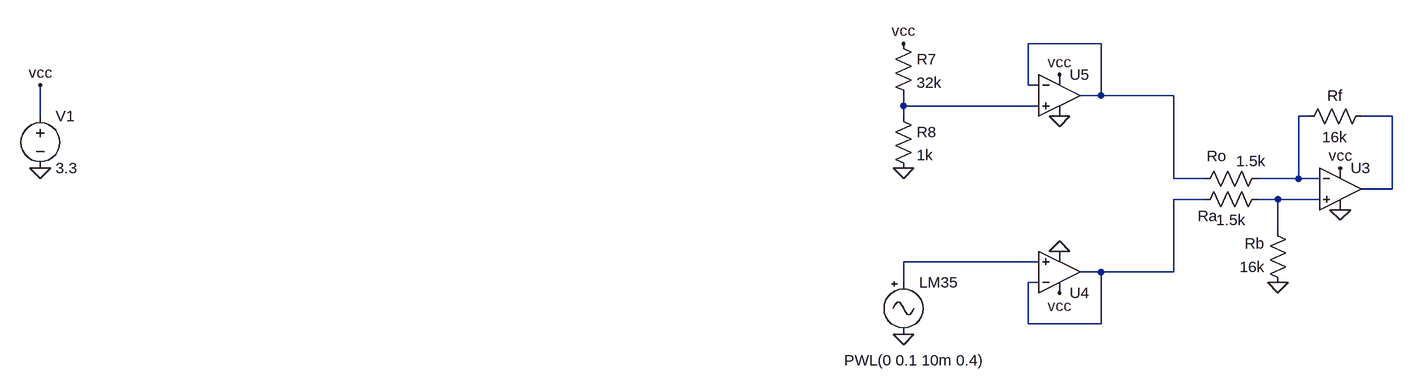
[diagram p0: schematic LM35DiffAmp.asc]
LM35DiffAmp.asc, the LTspice schematic file:
Version 4
SHEET 1 4004 680
WIRE 1760 0 1648 0
WIRE 1648 64 1648 0
WIRE 1664 64 1648 64
WIRE 1760 80 1760 0
WIRE 1760 80 1728 80
WIRE 1872 80 1760 80
WIRE 1456 96 1456 80
WIRE 1664 96 1456 96
WIRE 128 112 128 64
WIRE 1456 112 1456 96
WIRE 2080 112 2064 112
WIRE 2208 112 2160 112
WIRE 1872 208 1872 80
WIRE 1920 208 1872 208
WIRE 2064 208 2064 112
WIRE 2064 208 2000 208
WIRE 2096 208 2064 208
WIRE 2208 224 2208 112
WIRE 2208 224 2160 224
WIRE 1920 240 1872 240
WIRE 2032 240 2000 240
WIRE 2096 240 2032 240
WIRE 2032 288 2032 240
WIRE 1664 336 1456 336
WIRE 1760 352 1728 352
WIRE 1872 352 1872 240
WIRE 1872 352 1760 352
WIRE 1456 368 1456 336
WIRE 1664 368 1648 368
WIRE 1648 432 1648 368
WIRE 1760 432 1760 352
WIRE 1760 432 1648 432
FLAG 128 192 0
FLAG 128 64 vcc
FLAG 2128 256 0
FLAG 2128 192 vcc
FLAG 1696 384 vcc
FLAG 1696 320 0
FLAG 1456 448 0
FLAG 2032 368 0
FLAG 1696 48 vcc
FLAG 1696 112 0
FLAG 1456 192 0
FLAG 1456 0 vcc
SYMBOL Voltage 128 96 R0
SYMATTR InstName V1
SYMATTR Value 3.3
SYMBOL UniversalOpAmp 2128 224 R0
SYMATTR InstName U3
SYMBOL res 2048 384 R180
WINDOW 0 36 76 Left 2
WINDOW 3 36 40 Left 2
SYMATTR InstName Rb
SYMATTR Value 16k
SYMBOL res 2016 224 R90
WINDOW 0 57 92 VBottom 2
WINDOW 3 32 56 VTop 2
SYMATTR InstName Ra
SYMATTR Value 1.5k
SYMBOL UniversalOpAmp 1696 352 M180
SYMATTR InstName U4
SYMBOL Misc\\signal 1456 352 R0
WINDOW 3 -91 136 Left 2
WINDOW 123 0 0 Left 0
WINDOW 39 0 0 Left 0
SYMATTR Value PWL(0 0.1 10m 0.4)
SYMATTR InstName LM35
SYMBOL res 2016 192 R90
WINDOW 0 -3 78 VBottom 2
WINDOW 3 -27 25 VTop 2
SYMATTR InstName Ro
SYMATTR Value 1.5k
SYMBOL res 2176 96 R90
WINDOW 0 0 56 VBottom 2
WINDOW 3 32 56 VTop 2
SYMATTR InstName Rf
SYMATTR Value 16k
SYMBOL UniversalOpAmp 1696 80 R0
SYMATTR InstName U5
SYMBOL res 1440 -16 R0
SYMATTR InstName R7
SYMATTR Value 32k
SYMBOL res 1440 96 R0
SYMATTR InstName R8
SYMATTR Value 1k

The netlist it stands for:
* LM35DiffAmp.asc
V1 vcc 0 3.3
XU3 N006 N003 vcc 0 N004 level1 Avol=1Meg GBW=10Meg Vos=0 En=0 Enk=0 In=0 Ink=0 Rin=500Meg  ; pins In+ In- V+ V- OUT
Rb 0 N006 16k
Ra N006 N005 1.5k
XU4 N007 N005 vcc 0 N005 level1 Avol=1Meg GBW=10Meg Vos=0 En=0 Enk=0 In=0 Ink=0 Rin=500Meg  ; pins In+ In- V+ V- OUT
V§LM35 N007 0 PWL(0 0.1 10m 0.4)
Ro N003 N001 1.5k
Rf N004 N003 16k
XU5 N002 N001 vcc 0 N001 level1 Avol=1Meg GBW=10Meg Vos=0 En=0 Enk=0 In=0 Ink=0 Rin=500Meg  ; pins In+ In- V+ V- OUT
R7 vcc N002 32k
R8 N002 0 1k
.lib UniversalOpAmp1.lib
.backanno
.end